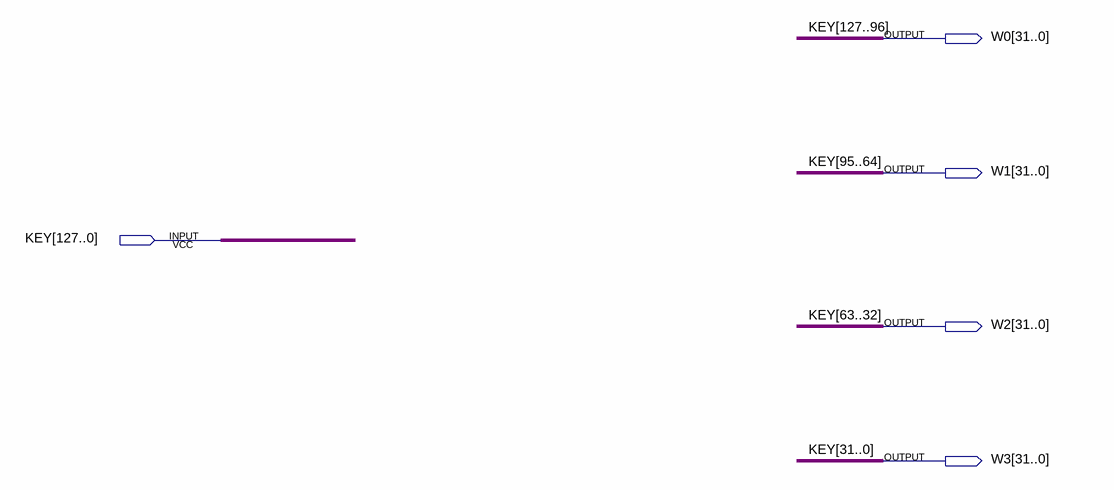
[diagram p0: schematic sheet]
// Quartus schematic ROUND0.bdf as structural Verilog: 0 symbols, 5 pins
module ROUND0 (
  input  [127:0] KEY,
  output [31:0] W0,
  output [31:0] W1,
  output [31:0] W2,
  output [31:0] W3
);


  assign W0 = KEY[127:96];
  assign W1 = KEY[95:64];
  assign W2 = KEY[63:32];
  assign W3 = KEY[31:0];
endmodule
